# EAGLE design Hardware_Midges (EAGLE 9.5.2)
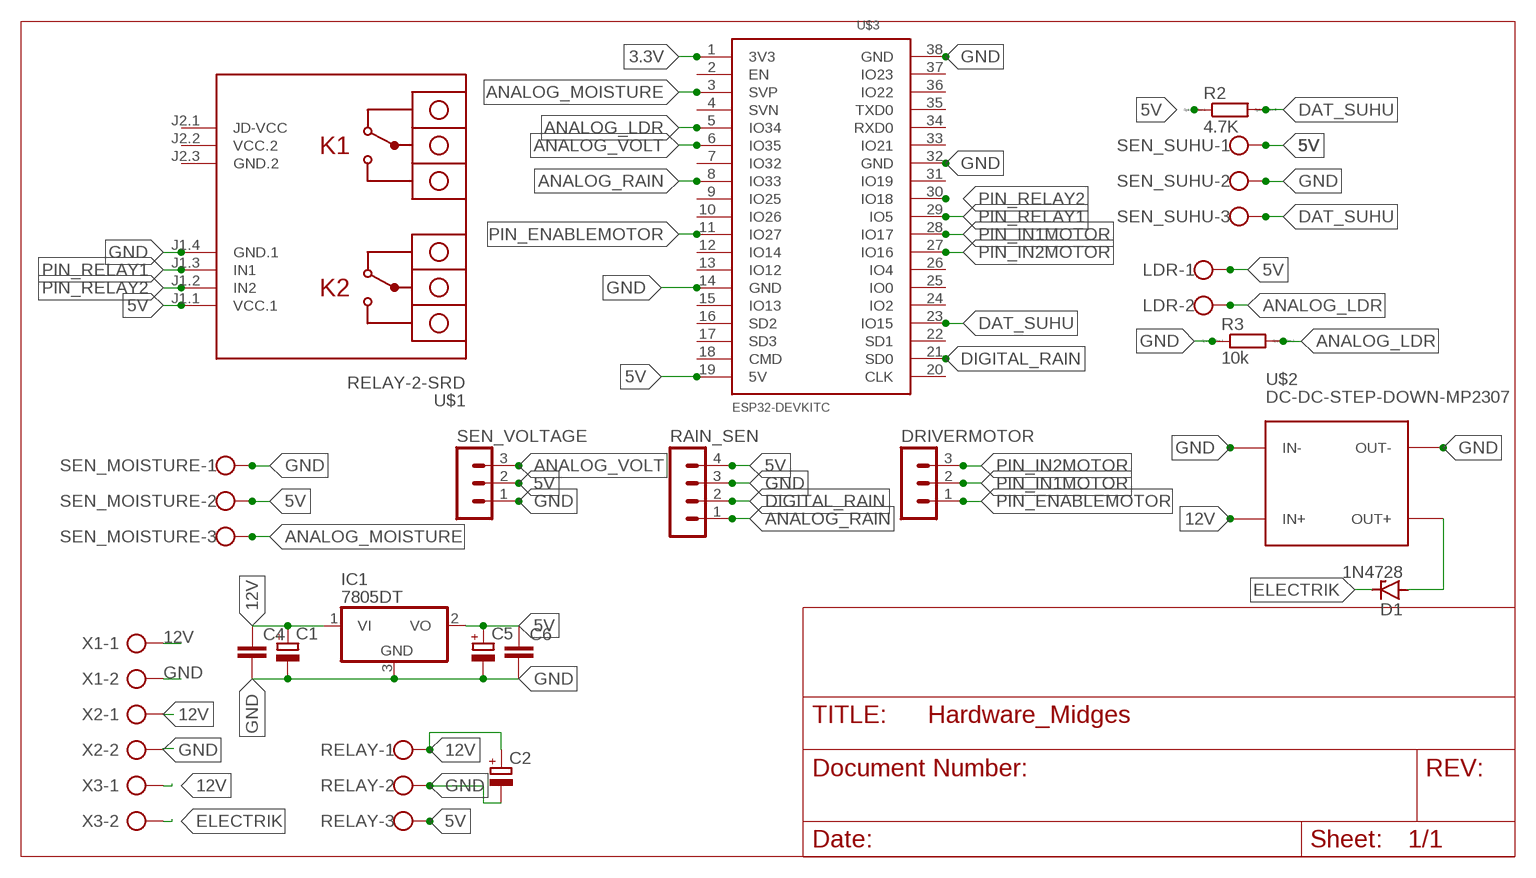
[diagram p0: schematic, sheet 1]

## Parts
C1  CPOL-EUE5-6  [E5-6]
C2  CPOL-EUE5-10.5  [E5-10,5]
C4  C-EU050-025X075  [C050-025X075]
C5  CPOL-EUE5-6  [E5-6]
C6  C-EU050-025X075  [C050-025X075]
D1  1N4728  [DO41Z10]
DRIVERMOTOR  MA03-1  [MA03-1]
IC1  7805DT  [TO252]
LDR  W237-102  [W237-102]
R2  4.7K  R0207/10  [0207/10]
R3  10k  R0207/10  [0207/10]
RAIN_SEN  MA04-1  [MA04-1]
RELAY  W237-103  [W237-103]
SEN_MOISTURE  W237-103  [W237-103]
SEN_SUHU  W237-103  [W237-103]
SEN_VOLTAGE  MA03-1  [MA03-1]
U$1  RELAY-2-SRD  [RELAY-2-SRD]
U$2  DC-DC-STEP-DOWN-MP2307  [DC-DC-STEP-DOWN-MP2307]
U$3  ESP32DEVKITC  [ESP32-DEVKITC]
X1  AK500/2-H  [AK500/2-H]
X2  AK500/2-H  [AK500/2-H]
X3  AK500/2-H  [AK500/2-H]

## Nets
3.3V: U$3.1(3V3)
5V: C5.+ C6.1 IC1.2(VO) LDR.1 R2.1 RAIN_SEN.4 RELAY.3 SEN_MOISTURE.2 SEN_SUHU.1 SEN_VOLTAGE.2 U$1.J1.1(VCC.1) U$3.19(5V)
12V: C1.+ C2.+ C4.1 IC1.1(VI) RELAY.1 U$2.IN+ X1.1 X2.1 X3.1
ANALOG_LDR: LDR.2 R3.2 U$3.5(IO34)
ANALOG_MOISTURE: SEN_MOISTURE.3 U$3.3(SVP)
ANALOG_RAIN: RAIN_SEN.1 U$3.8(IO33)
ANALOG_VOLT: SEN_VOLTAGE.3 U$3.6(IO35)
DAT_SUHU: R2.2 SEN_SUHU.3 U$3.23(IO15)
DIGITAL_RAIN: RAIN_SEN.2 U$3.21(SD0)
ELECTRIK: D1.C X3.2
GND: C1.- C2.- C4.2 C5.- C6.2 IC1.3(GND) R3.1 RAIN_SEN.3 RELAY.2 SEN_MOISTURE.1 SEN_SUHU.2 SEN_VOLTAGE.1 U$1.J1.4(GND.1) U$2.IN- U$2.OUT- U$3.14(GND) U$3.32(GND) U$3.38(GND) X1.2 X2.2
N$1: D1.A U$2.OUT+
PIN_ENABLEMOTOR: DRIVERMOTOR.1 U$3.11(IO27)
PIN_IN1MOTOR: DRIVERMOTOR.2 U$3.28(IO17)
PIN_IN2MOTOR: DRIVERMOTOR.3 U$3.27(IO16)
PIN_RELAY1: U$1.J1.3(IN1) U$3.29(IO5)
PIN_RELAY2: U$1.J1.2(IN2) U$3.30(IO18)
Unconnected: U$1.J2.1(JD-VCC) U$3.2(EN) U$3.4(SVN) U$3.7(IO32) U$3.9(IO25) U$3.10(IO26) U$3.12(IO14) U$3.13(IO12) U$3.15(IO13) U$3.16(SD2) U$3.17(SD3) U$3.18(CMD) U$3.20(CLK) U$3.22(SD1) U$3.24(IO2) U$3.25(IO0) U$3.26(IO4) U$3.31(IO19) U$3.33(IO21) U$3.34(RXD0) U$3.35(TXD0) U$3.36(IO22) U$3.37(IO23)

## Power pins joined to a net without a drawn wire
GND.2: U$1.J2.3(GND.2)
VCC.2: U$1.J2.2(VCC.2)

## Library data of the parts
C1 C2 C5 = rcl:CPOL-EU: POLARIZED CAPACITOR, European symbol; SPICEPREFIX: C
C4 C6 = rcl:C-EU: CAPACITOR, European symbol; SPICEPREFIX: C
D1 = diode:1N4728: Z DIODE 3.3 V, 1W, 5 percent
DRIVERMOTOR SEN_VOLTAGE = con-lstb:MA03-1: PIN HEADER; OC_FARNELL: unknown; OC_NEWARK: unknown
IC1 = linear:78*: Positive VOLTAGE REGULATOR Source: http://cache.national.com/ds/LM/LM78L05.pdf http://www.fairchildsemi.com/ds/LM/LM7805.pdf
LDR = con-wago-500:W237-102: WAGO SCREW CLAMP; MPN: 237-102; OC_FARNELL: unknown; OC_NEWARK: 70K9898
R2 R3 = eagle-ltspice:R: RESISTOR, European symbol; SPICEMODEL: NONE; SPICEPREFIX: R
RAIN_SEN = con-lstb:MA04-1: PIN HEADER; OC_FARNELL: unknown; OC_NEWARK: unknown
RELAY SEN_MOISTURE SEN_SUHU = con-wago-500:W237-103: WAGO SCREW CLAMP; MPN: 237-103; OC_FARNELL: unknown; OC_NEWARK: 18M7116
U$1 = diy-modules:RELAY-2-SRD: 2-Channel Relay Module based on SRD-05VDC-SL-C relays Click here to find device on ebay.com <http://www.ebay.com/sch/two+channel+relay+module+optocoupler+5v>
U$2 = diy-modules:DC-DC-STEP-DOWN-MP2307: DC/DC Step-Down Regulator based on MP2307DN chip MP2307 datasheet available here: https://cdn-shop.adafruit.com/datasheets/MP2307_r1.9.pdf Click here to find device on ebay.com <http://www.ebay.com/sch/dc+dc+3a+mini+converter>
U$3 = ESP32-DEVKITC:ESP32DEVKITC
X1-X3 = con-ptr500:AK500/2-H: CONNECTOR Aug. 2004 / PTR Meßtechnik: Die Bezeichnung der Serie AK505 wurde geändert. Es handelt sich hierbei um AK500 in horizontaler Ausführung.; OC_FARNELL: unknown; OC_NEWARK: unknown

## Board
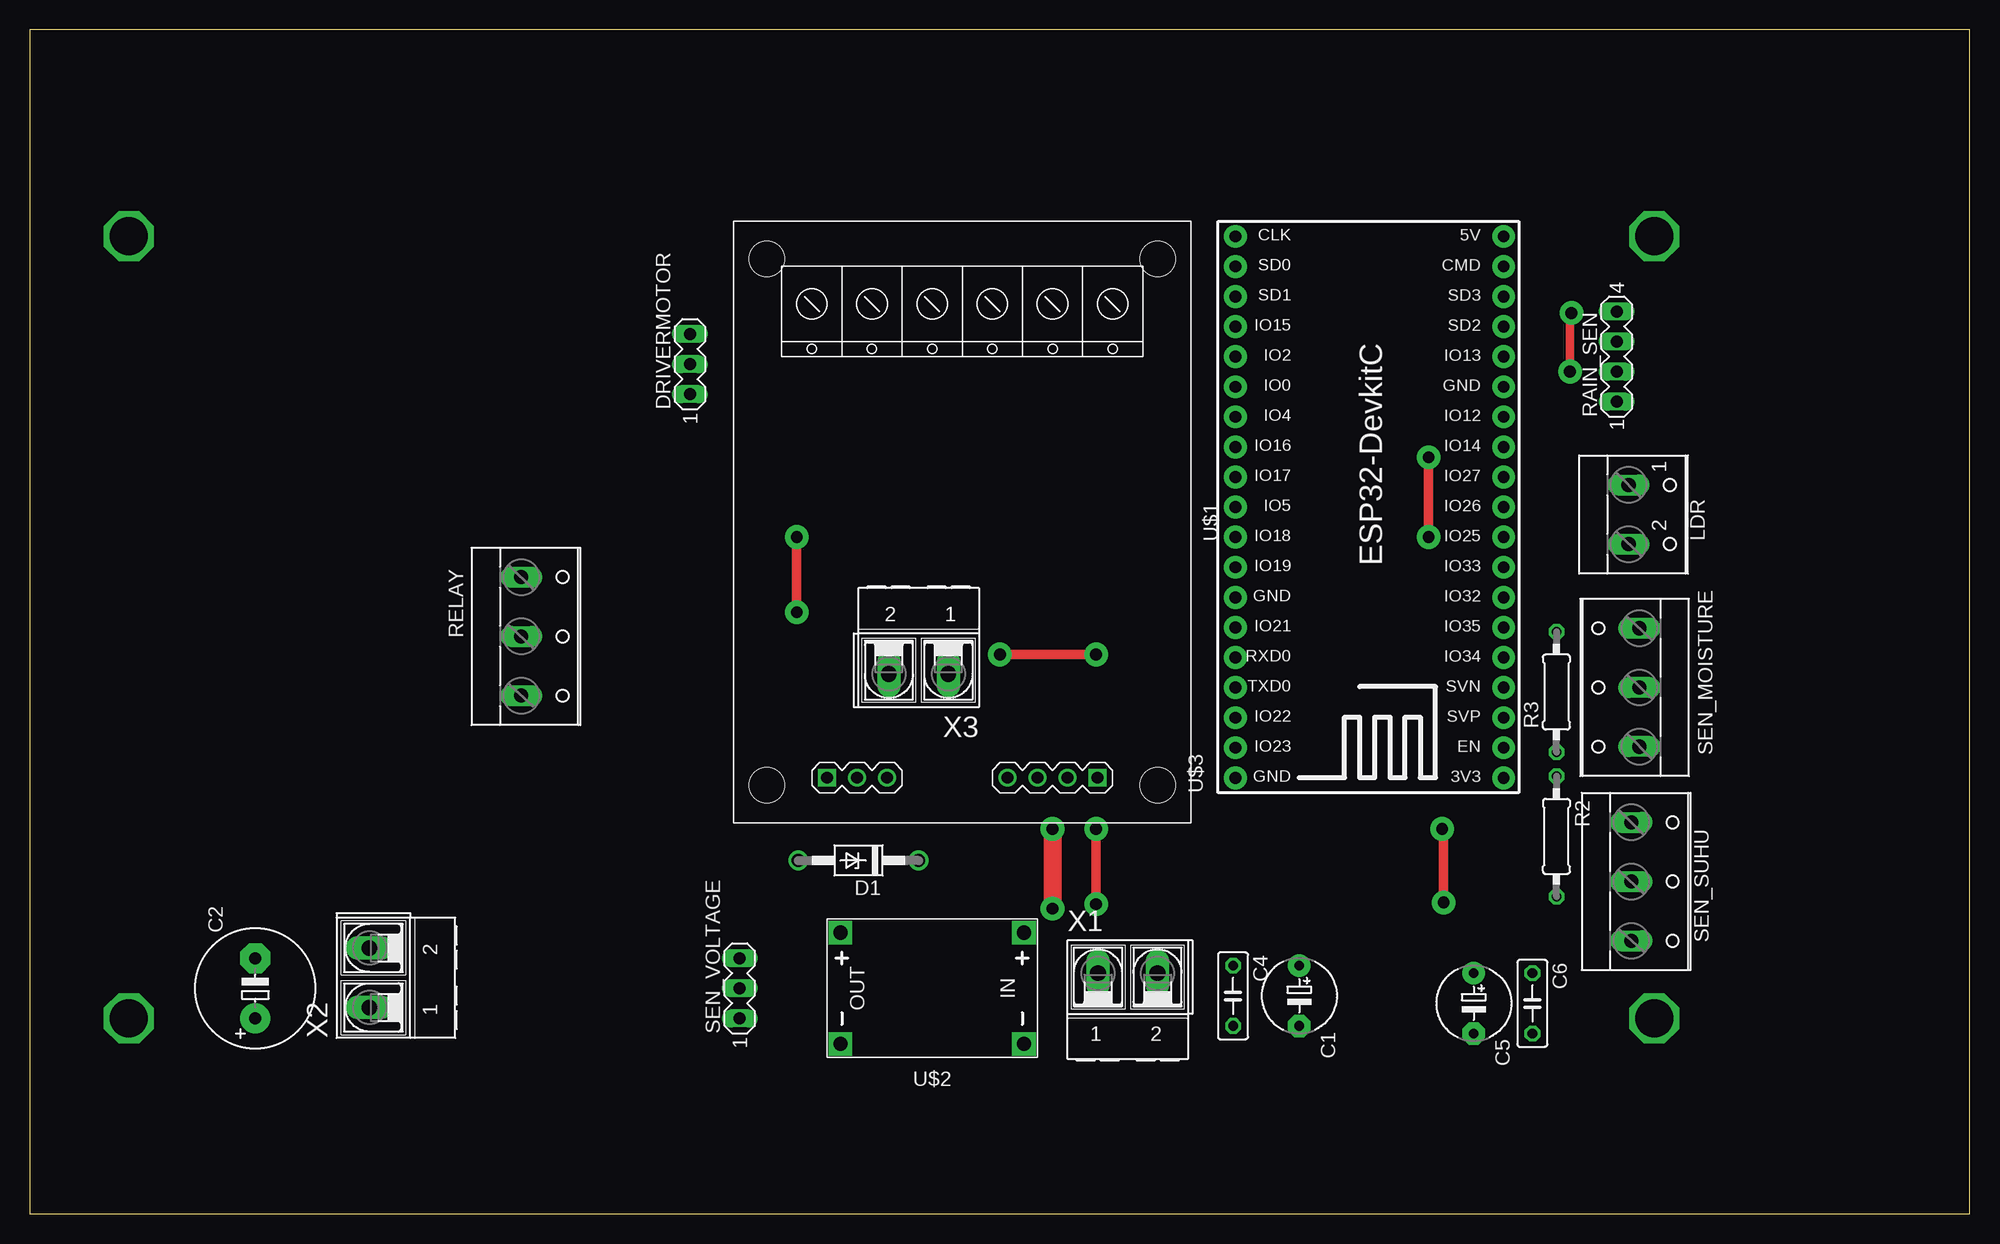
[diagram p1: board, top side]
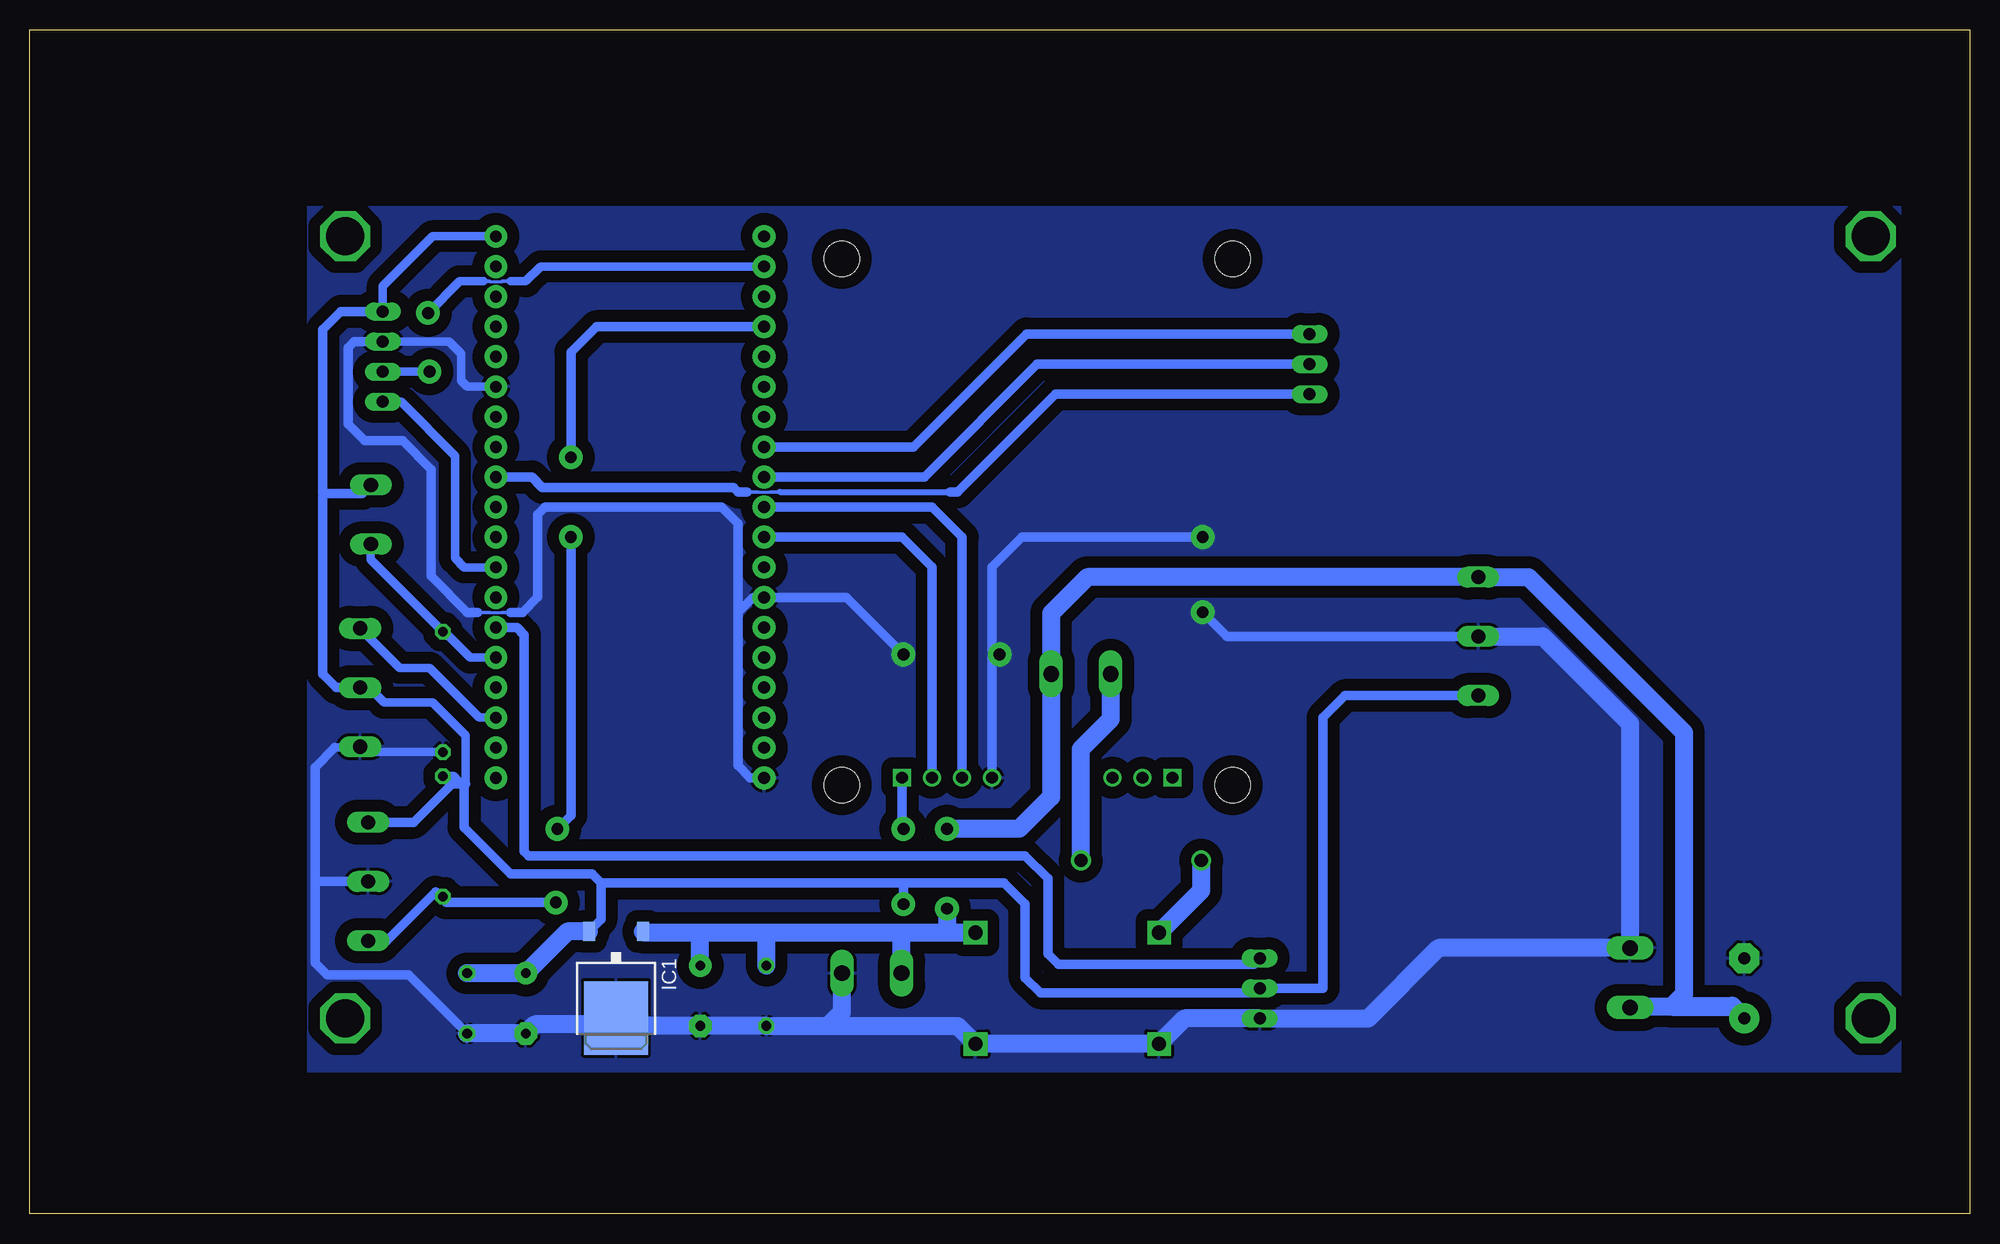
[diagram p2: board, bottom side, seen from below]

Size 163.81 x 100 mm. Coordinates in mm from the lower left corner, seen from the top.
Outline: 0,0 163.81,0 163.81,100 0,100 0,0
Copper layers (1*16): Top 0.035mm / dielectric 1.5mm / Bottom 0.035mm
Design rules "default": minimum track width 6mil, minimum drill 0.35mm, track to track 6mil, track to pad 6mil, pad to pad 6mil, via to via 6mil, smd to smd 6mil, copper to edge 40mil, drill to drill 6mil, minimum pad ring 10mil, minimum via ring 8mil, stop-mask expansion 4mil, vias tented up to drill 0mil, thermal gap 10mil

### Footprints (pad centres in the part's own frame; a part is rotated, then mirrored left to right if it is on the bottom)
E5-6 = drill 0.813 pad 1.905: + -2.54,0 | drill 0.813 pad 1.905 octagon: - 2.54,0
E5-10,5 = drill 1.016 pad 2.54: + -2.54,0 | drill 1.016 pad 2.54 octagon: - 2.54,0
C050-025X075 = drill 0.813 octagon: 1 -2.54,0; 2 2.54,0
DO41Z10 = drill 1.118: A 5.08,0; C -5.08,0
MA03-1 = drill 1.016 long: 1 -2.54,0; 2 0,0; 3 2.54,0
TO252 = smd 1 x 1.6: 1 -2.28,-4.8; 2 2.28,-4.8 | smd 5.4 x 6.2: 3 0,2.5
W237-102 = drill 1.194 long: 1 -2.5,-1.27; 2 2.5,-1.27
0207/10 = drill 0.813 octagon: 1 -5.08,0; 2 5.08,0
MA04-1 = drill 1.016 long: 1 -3.81,0; 2 -1.27,0; 3 1.27,0; 4 3.81,0
W237-103 = drill 1.194 long: 1 -5,-1.29; 2 0,-1.29; 3 5,-1.29
RELAY-2-SRD = drill 1 square: J1.1 21.59,11.43; J2.1 21.59,-11.43 | drill 1: J1.2 21.59,8.89; J1.3 21.59,6.35; J1.4 21.59,3.81; J2.2 21.59,-8.89; J2.3 21.59,-6.35 | hole 3: -22.225,16.51; 22.225,16.51; 22.225,-16.51; -22.225,-16.51
DC-DC-STEP-DOWN-MP2307 = drill 1.2 pad 2 square: IN+ -7.747,-4.699; IN- -7.747,4.699; OUT+ 7.747,-4.699; OUT- 7.747,4.699
ESP32-DEVKITC = drill 1 pad 1.93: 1 -22.87,-11.42; 2 -20.33,-11.42; 3 -17.79,-11.42; 4 -15.25,-11.42; 5 -12.71,-11.42; 6 -10.17,-11.42; 7 -7.63,-11.42; 8 -5.09,-11.42; 9 -2.55,-11.42; 10 -0.01,-11.42; 11 2.53,-11.42; 12 5.07,-11.42; 13 7.61,-11.42; 14 10.15,-11.42; 15 12.69,-11.42; 16 15.23,-11.42; 17 17.77,-11.42; 18 20.31,-11.42; 19 22.85,-11.42; 20 22.85,11.23; 21 20.31,11.23; 22 17.77,11.23; 23 15.23,11.23; 24 12.69,11.23; 25 10.15,11.23; 26 7.61,11.23; 27 5.07,11.23; 28 2.53,11.23; 29 -0.01,11.23; 30 -2.55,11.23; 31 -5.09,11.23; 32 -7.63,11.23; 33 -10.17,11.23; 34 -12.71,11.23; 35 -15.25,11.23; 36 -17.79,11.23; 37 -20.33,11.23; 38 -22.87,11.23
AK500/2-H = drill 1.321 long: 1 -2.515,0; 2 2.515,0

### Placement (x,y rotation side)
C1  107.19,18.41 270 top
C2  19.05,19.05 90 top
C4  101.6,18.41 270 top
C5  121.92,17.78 270 top
C6  126.87,17.78 270 top
D1  69.98,29.84 180 top
DRIVERMOTOR  55.75,71.75 90 top
IC1  114.3,19.05 180 bottom
LDR  136.27,59.05 270 top
R2  128.91,31.88 270 top
R3  128.91,44.07 90 top
RAIN_SEN  133.99,72.39 90 top
RELAY  42.8,48.77 270 top
SEN_MOISTURE  134.62,44.45 90 top
SEN_SUHU  136.53,28.07 270 top
SEN_VOLTAGE  59.94,19.05 90 top
U$1  78.74,58.42 270 top
U$2  76.2,19.05 180 top
U$3  113.03,59.69 90 top
X1  92.71,20.32 0 top
X2  28.7,19.94 90 top
X3  75.06,45.59 180 top

### Tracks (layer width: path | path; a pad name or v marks a point on that pad's centre or on a via)
5V  (via drill 1 pad 2)
  Top 0.8: v90.04,32.51 v90.04,26.16
  Bottom 0.7: 127,36.32 127,40.39 129.79,43.18 133.88,43.18 135.15,44.45 SEN_MOISTURE.2 | U$3.19 129.8,82.54 133.99,78.36 RAIN_SEN.4
  Bottom 0.8: RAIN_SEN.4 137.54,76.2 139.06,74.68 139.06,60.83 138.81,60.83 | 138.81,60.83 135.72,60.83 LDR.1 | SEN_MOISTURE.2 137.92,44.45 139.06,45.59 139.06,60.58 138.81,60.83 | 127,36.32 128.27,36.32 R2.1 128.02,36.96 127.89,36.83 | 127.89,36.83 127.89,36.58 131.4,33.07 SEN_SUHU.1 | RELAY.3 52.75,43.77 54.61,41.91 54.61,19.05 SEN_VOLTAGE.2 60.33,18.67 78.49,18.67 79.76,19.94 79.76,26.16 81.53,27.94 90.17,27.94 | 115.57,27.94 115.57,24.86 IC1.2 | 115.57,27.94 90.17,27.94 | U$1.J1.1 90.17,32.64 v90.04,32.51 | v90.04,26.16 90.04,27.81 90.17,27.94 | 115.57,27.94 116.33,28.7 123.19,28.7 127.13,32.64 127.13,36.07 127.89,36.83
  Bottom 1.5: IC1.2 118.39,23.85 C5.+ C6.1
12V  (via drill 1 pad 2)
  Top 1.5: v86.36,32.51 v86.36,25.78
  Bottom 1.5: U$2.IN+ 86.23,23.75 | 86.23,23.75 90.3,23.75 | 90.3,23.75 101.47,23.75 | 101.47,23.75 107.31,23.75 | 107.31,23.75 111.92,23.75 IC1.1 | C1.+ 107.19,23.62 107.31,23.75 | C4.1 101.6,23.62 101.47,23.75 | X1.1 90.2,23.65 90.3,23.75 | X2.1 28.6,17.53 25.15,17.53 24.13,18.54 24.13,40.64 37.26,53.77 RELAY.1 74.5,53.77 77.57,50.7 X3.1 77.57,35.2 80.26,32.51 v86.36,32.51 | 86.23,23.75 86.36,23.88 v86.36,25.78
  Bottom 1.6: 25.15,17.53 20.07,17.53 C2.+
ANALOG_LDR
  Bottom 0.7: U$3.5 126.61,46.98 128.78,49.15 R3.2 135,55.24 LDR.2
ANALOG_MOISTURE
  Bottom 0.7: U$3.3 125.85,41.9 130.05,46.1 132.59,46.1 135.91,49.42 SEN_MOISTURE.3
ANALOG_RAIN
  Bottom 0.7: U$3.8 127.12,54.6 127.89,55.37 127.89,64.01 132.46,68.58 RAIN_SEN.1
ANALOG_VOLT
  Bottom 0.8: SEN_VOLTAGE.3 60.45,21.08 76.96,21.08 77.85,21.97 77.85,28.32 79.76,30.23 121.67,30.23 122.05,30.61 122.05,48.9 122.67,49.52 U$3.6
DAT_SUHU  (via drill 1 pad 2)
  Top 0.8: v119.38,26.29 119.38,32.38 v119.25,32.51 | v118.11,57.15 v118.11,63.88
  Bottom 0.8: 128.91,26.54 R2.2 | SEN_SUHU.3 133.65,23.07 129.54,27.18 128.91,26.54 | 128.91,26.54 128.65,26.29 v119.38,26.29 | v119.25,32.51 118.11,33.66 v118.11,57.15 | v118.11,63.88 118.11,72.77 115.96,74.92 U$3.23
DIGITAL_RAIN  (via drill 1 pad 2)
  Top 0.7: v130.17,76.07 130.05,75.95 v130.05,71.12
  Bottom 0.25: 124.98,78.73 123.92,78.73
  Bottom 0.3: 125.48,78.74 124.98,78.74 124.98,78.73 | 123.92,78.73 123.92,78.74 123.19,78.74
  Bottom 0.7: RAIN_SEN.2 v130.05,71.12 | v130.17,76.07 127.51,78.74 125.48,78.74 | 123.19,78.74 121.92,78.74 120.66,80 U$3.21
ELECTRIK
  Bottom 1.5: D1.C 75.06,39.24 72.52,41.78 72.52,45.57 X3.2
GND  (via drill 1 pad 2)
  Top 0.8: v64.77,50.8 v64.77,57.15 | v81.92,47.24 v90.04,47.24
  Bottom 0.25: 124.98,50.79 123.92,50.79
  Bottom 0.3: 125.98,50.8 124.98,50.8 124.98,50.79 | 123.92,50.79 123.92,50.8 123.19,50.8
  Bottom 0.7: SEN_MOISTURE.1 135.83,39.37 137.23,39.37 | 137.23,39.37 136.85,38.99 R3.1 | 138.05,39.37 137.23,39.37 | RAIN_SEN.3 128.4,73.66 127.38,72.64 127.38,70.36 126.86,69.84 U$3.14
  Bottom 0.8: 139.7,28.07 139.7,21.21 138.68,20.19 131.83,20.19 C6.2 | 139.7,28.07 SEN_SUHU.2 | 139.7,28.07 139.7,37.72 138.05,39.37 | RELAY.2 62.74,48.77 v64.77,50.8 | v64.77,57.15 80.01,57.15 82.55,54.61 82.55,46.61 | 82.55,46.61 U$1.J1.4 | 82.55,46.61 v81.92,47.24 | v90.04,47.24 94.86,52.06 U$3.32 102.75,52.06 104.01,50.8 | U$3.38 102.99,36.82 104.01,37.85 104.01,50.8 | RAIN_SEN.3 136.4,73.66 136.91,73.15 136.91,66.67 135.51,65.28 132.33,65.28 129.92,62.87 129.92,53.85 126.87,50.8 125.98,50.8 | 123.19,50.8 122.17,50.8 120.9,52.07 120.9,59.05 120.27,59.69 105.41,59.69 104.01,58.29 104.01,50.8
  Bottom 1.5: X1.2 95.25,20.3 95.25,17.02 96.39,15.88 | 96.39,15.88 C4.2 C1.- 112.9,15.88 113.67,16.64 114.21,16.64 IC1.3 114.85,16 121.16,16 C5.- C6.2 | 96.39,15.88 85.47,15.88 U$2.IN- U$2.OUT- 66.29,16.51 SEN_VOLTAGE.1 50.8,16.51 44.86,22.45 X2.2 28.7,41.4 36.07,48.77 RELAY.2
  pour Bottom (isolate 1): 5.84,85.09 5.84,11.94 140.34,11.94 140.34,85.09
N$1
  Bottom 1.5: U$2.OUT+ 64.9,27.3 D1.A
N$2  (via drill 3.2 pad 0.6)
  other vias: 137.16,82.55
N$3  (via drill 3.2 pad 0.6)
  other vias: 8.38,82.55
N$4  (via drill 3.2 pad 0.6)
  other vias: 137.16,16.51
N$5  (via drill 3.2 pad 0.6)
  other vias: 8.38,16.51
PIN_ENABLEMOTOR
  Bottom 0.25: 102.33,60.95 101.28,60.95
  Bottom 0.3: 103.25,60.96 102.33,60.96 102.33,60.95 | 101.28,60.95 101.27,60.96 100.46,60.96
  Bottom 0.5: 100.46,60.96 86.11,60.96
  Bottom 0.8: DRIVERMOTOR.1 77.22,69.22 85.47,60.96 86.11,60.96 | U$3.11 121.4,62.22 120.52,61.34 104.39,61.34 104.01,60.96 103.25,60.96
PIN_IN1MOTOR
  Bottom 0.8: U$3.28 88.28,62.22 78.74,71.75 DRIVERMOTOR.2
PIN_IN2MOTOR
  Bottom 0.8: U$3.27 89.16,64.76 79.63,74.3 DRIVERMOTOR.3
PIN_RELAY1
  Bottom 0.8: U$3.29 87.62,59.68 85.09,57.15 U$1.J1.3
PIN_RELAY2
  Bottom 0.8: U$3.30 90.16,57.14 87.63,54.61 U$1.J1.2